# EAGLE design IOIO (EAGLE 5.11)
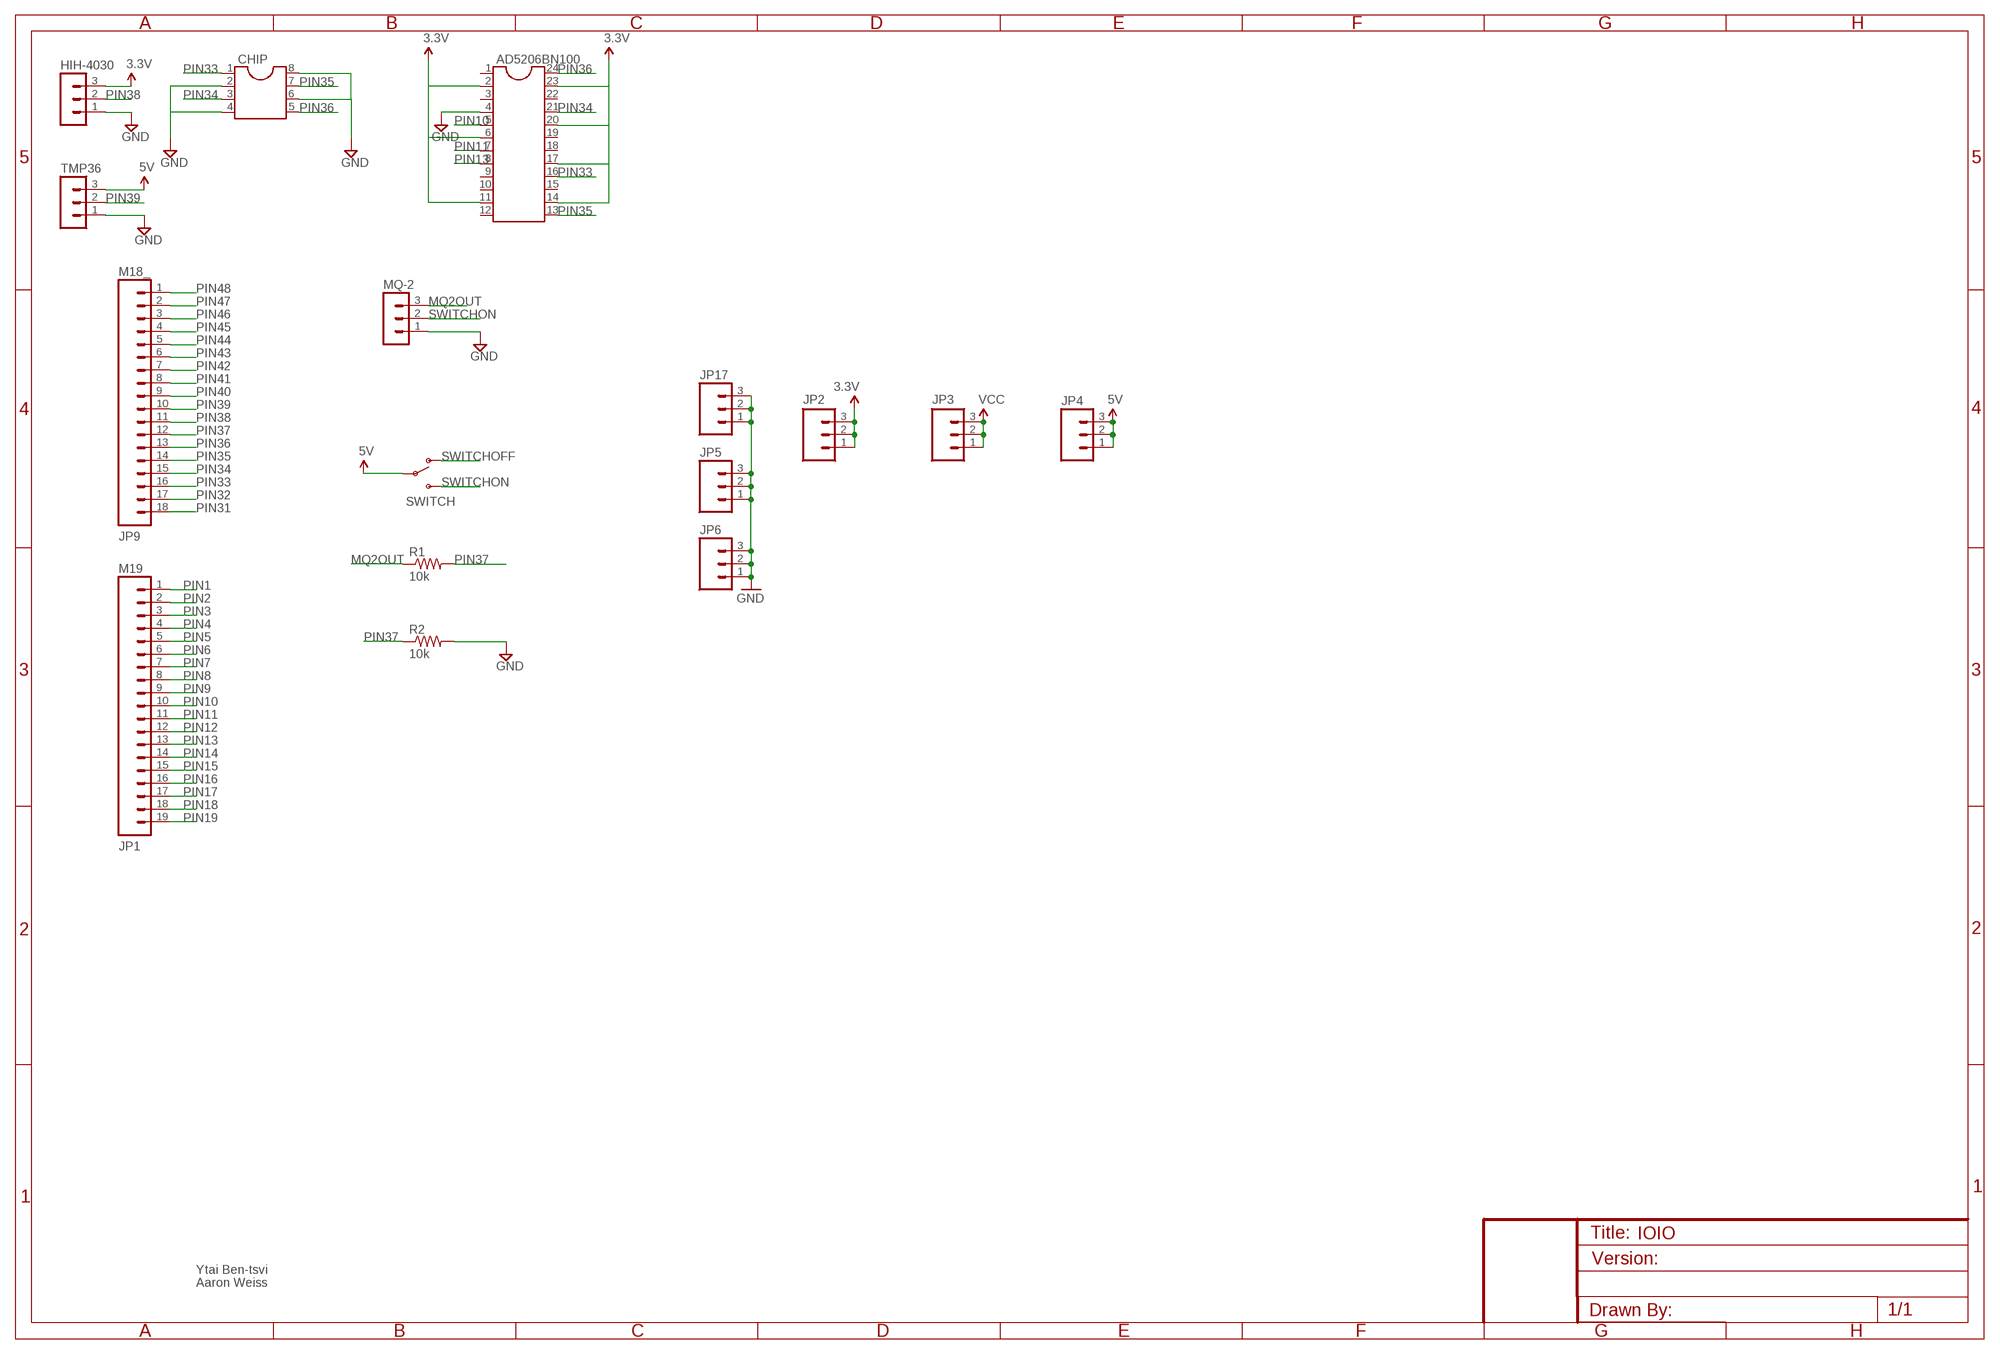
[diagram p0: schematic, sheet 1]

## Parts
AD5206BN100  DIL24-3  [DIL24-3]
CHIP  DIL8S  [SOCKET-08]
HIH-4030  MA03-1  [MA03-1]
JP1  M19  [1X19]
JP2  M03PTH  [1X03]
JP3  M03PTH  [1X03]
JP4  M03PTH  [1X03]
JP5  M03PTH  [1X03]
JP6  M03PTH  [1X03]
JP9  M18_  [1X18]
JP17  M03PTH  [1X03]
MQ-2  MA03-1  [MA03-1]
R1  10k  R-US_0207/7  [0207/7]
R2  10k  R-US_0207/7  [0207/7]
SWITCH  SWITCH-SPSTPTH_LOCK  [SWITCH-SPDT_LOCK.007S]
TMP36  MA03-1  [MA03-1]

## Nets
3.3V: AD5206BN100.2 AD5206BN100.6 AD5206BN100.11 AD5206BN100.14 AD5206BN100.17 AD5206BN100.20 AD5206BN100.23 HIH-4030.3 JP2.1 JP2.2 JP2.3
5V: JP4.1 JP4.2 JP4.3 SWITCH.2(P) TMP36.3
GND: AD5206BN100.4 CHIP.2 CHIP.4 CHIP.6 CHIP.8 HIH-4030.1 JP5.1 JP5.2 JP5.3 JP6.1 JP6.2 JP6.3 JP17.1 JP17.2 JP17.3 MQ-2.1 R2.2 TMP36.1
MQ2OUT: MQ-2.3 R1.1
PIN1: JP1.1
PIN2: JP1.2
PIN3: JP1.3
PIN4: JP1.4
PIN5: JP1.5
PIN6: JP1.6
PIN7: JP1.7
PIN8: JP1.8
PIN9: JP1.9
PIN10: AD5206BN100.5 JP1.10
PIN11: AD5206BN100.7 JP1.11
PIN12: JP1.12
PIN13: AD5206BN100.8 JP1.13
PIN14: JP1.14
PIN15: JP1.15
PIN16: JP1.16
PIN17: JP1.17
PIN18: JP1.18
PIN19: JP1.19
PIN31: JP9.18
PIN32: JP9.17
PIN33: AD5206BN100.16 CHIP.1 JP9.16
PIN34: AD5206BN100.21 CHIP.3 JP9.15
PIN35: AD5206BN100.13 CHIP.7 JP9.14
PIN36: AD5206BN100.24 CHIP.5 JP9.13
PIN37: JP9.12 R1.2 R2.1
PIN38: HIH-4030.2 JP9.11
PIN39: JP9.10 TMP36.2
PIN40: JP9.9
PIN41: JP9.8
PIN42: JP9.7
PIN43: JP9.6
PIN44: JP9.5
PIN45: JP9.4
PIN46: JP9.3
PIN47: JP9.2
PIN48: JP9.1
SWITCHOFF: SWITCH.1(O)
SWITCHON: MQ-2.2 SWITCH.3(S)
VCC: JP3.1 JP3.2 JP3.3
Unconnected: AD5206BN100.1 AD5206BN100.3 AD5206BN100.9 AD5206BN100.10 AD5206BN100.12 AD5206BN100.15 AD5206BN100.18 AD5206BN100.19 AD5206BN100.22

## Notes on the sheet
- Ytai Ben-tsvi
- Aaron Weiss

## Library data of the parts
AD5206BN100 = ic-package:DIL24: Dual In Line
CHIP = ic-package:DIL8: Dual In Line / Socket
HIH-4030 MQ-2 TMP36 = con-lstb:MA03-1: PIN HEADER; OC_FARNELL: unknown; OC_NEWARK: unknown
JP1 = SparkFun:M19
JP2-JP6 JP17 = SparkFun:M03: Header 3 Standard 3-pin 0.1" header. Use with straight break away headers (SKU : PRT-00116), right angle break away headers (PRT-00553), swiss pins (PRT-00743), machine pins (PRT-00117), and female headers (PRT-00115). Molex polarized connector foot print use with SKU : PRT-08232 with associated crimp pins and housings.
JP9 = SparkFun:M18
R1 R2 = resistor:R-US_: RESISTOR, American symbol
SWITCH = SparkFun:SWITCH-SPST: SPST Switch Simple slide switch. Spark Fun Electronics SKU : COM-00102

## Board
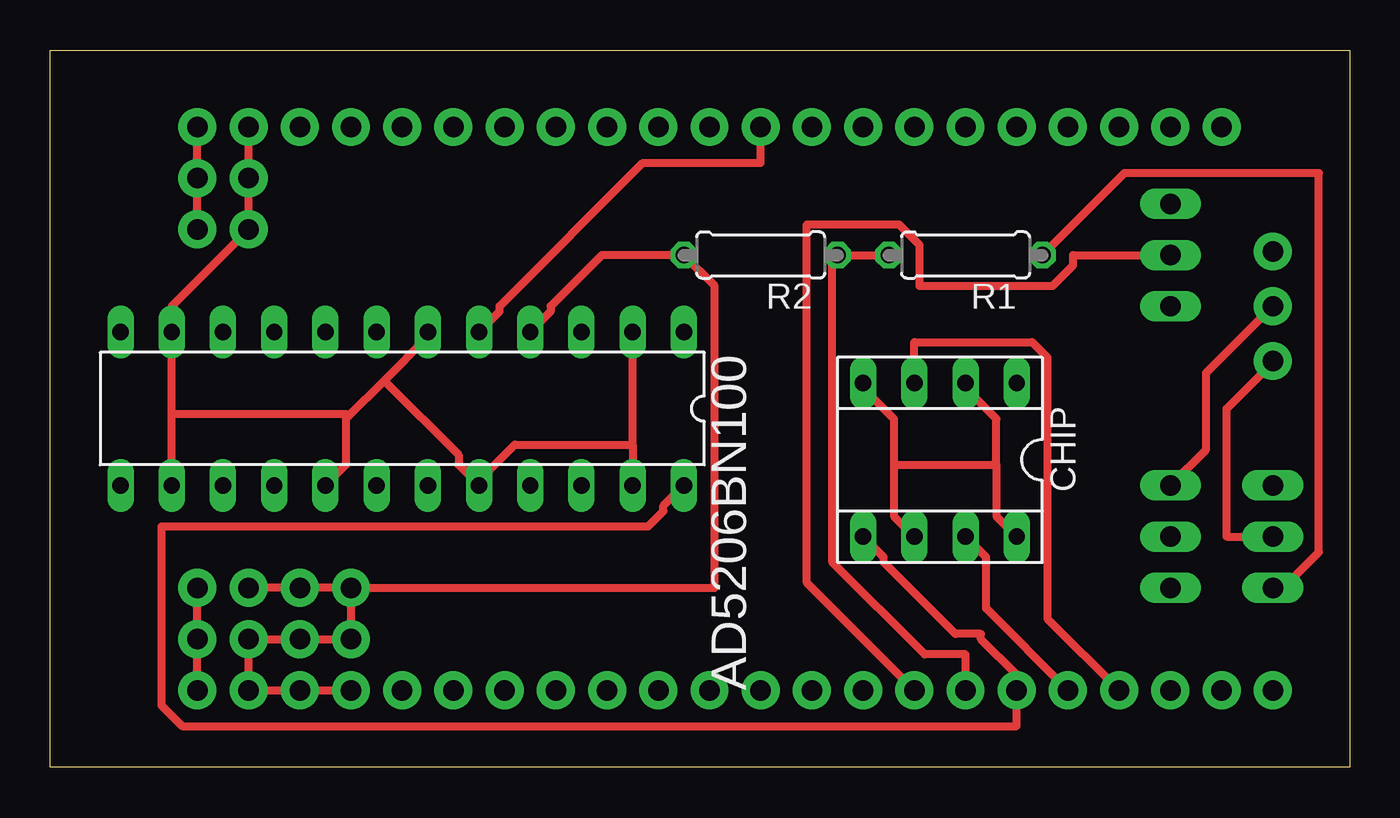
[diagram p1: board, top side]
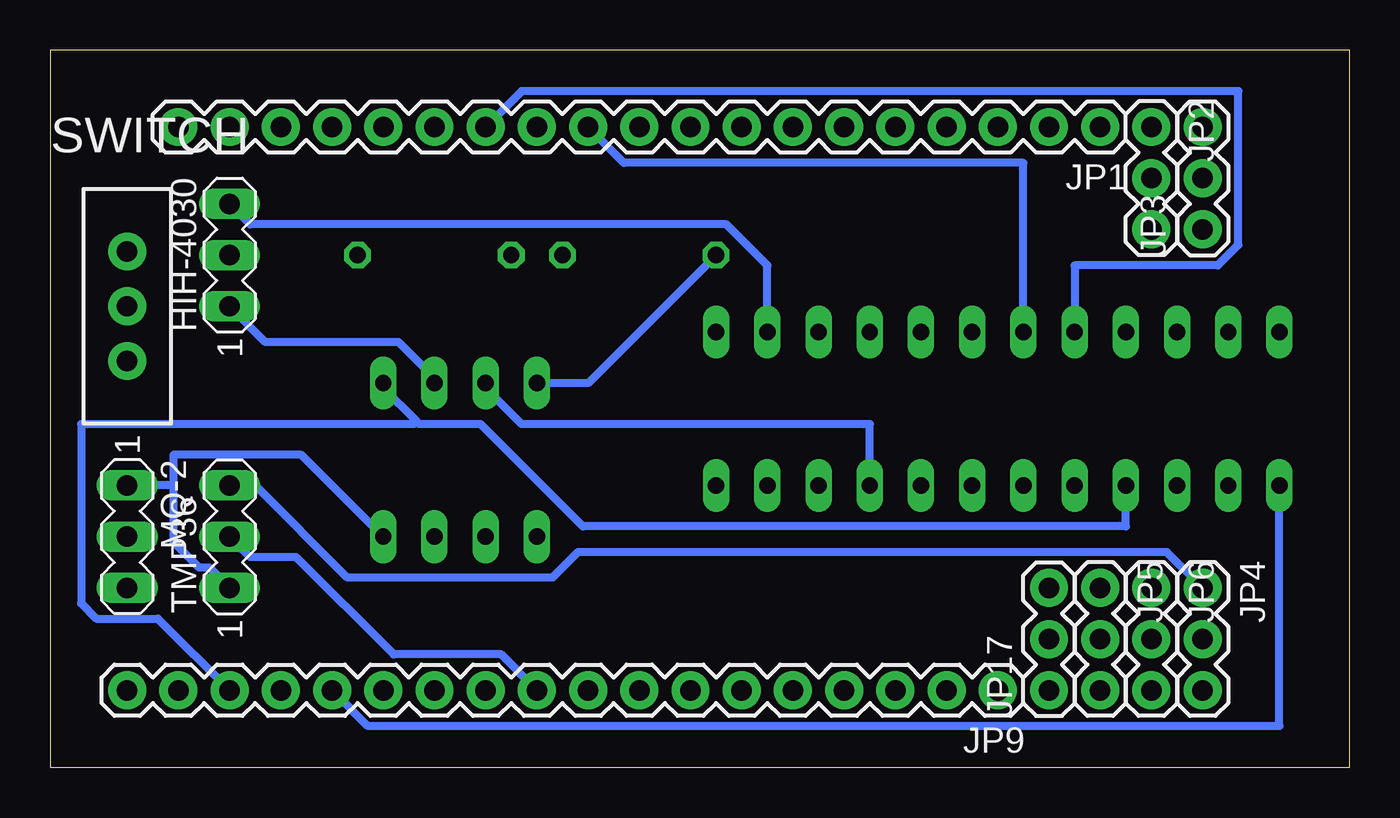
[diagram p2: board, bottom side, seen from below]

Size 64.44 x 35.55 mm. Coordinates in mm from the lower left corner, seen from the top.
Outline: 64.44,0 0,0 0,35.55 64.44,35.55 64.44,0
Copper layers (1*16): Top 0.035mm / dielectric 1.5mm / Bottom 0.035mm
Design rules "default *": minimum track width 16mil, minimum drill 24mil, track to track 20mil, track to pad 20mil, pad to pad 20mil, via to via 20mil, smd to smd 20mil, copper to edge 40mil, drill to drill 8mil, minimum pad ring 10mil, minimum via ring 8mil, stop-mask expansion 4mil, vias tented up to drill 0mil, thermal gap 10mil

### Footprints (pad centres in the part's own frame; a part is rotated, then mirrored left to right if it is on the bottom)
DIL24-3 = drill 0.813 long: 1 -13.97,-3.81; 2 -11.43,-3.81; 3 -8.89,-3.81; 4 -6.35,-3.81; 5 -3.81,-3.81; 6 -1.27,-3.81; 7 1.27,-3.81; 8 3.81,-3.81; 9 6.35,-3.81; 10 8.89,-3.81; 11 11.43,-3.81; 12 13.97,-3.81; 13 13.97,3.81; 14 11.43,3.81; 15 8.89,3.81; 16 6.35,3.81; 17 3.81,3.81; 18 1.27,3.81; 19 -1.27,3.81; 20 -3.81,3.81; 21 -6.35,3.81; 22 -8.89,3.81; 23 -11.43,3.81; 24 -13.97,3.81
SOCKET-08 = drill 0.813 long: 1 -3.81,-3.81; 2 -1.27,-3.81; 3 1.27,-3.81; 4 3.81,-3.81; 5 3.81,3.81; 6 1.27,3.81; 7 -1.27,3.81; 8 -3.81,3.81
MA03-1 = drill 1.016 long: 1 -2.54,0; 2 0,0; 3 2.54,0
1X19 = drill 1.016 pad 1.88 round: 1 0,0; 2 2.54,0; 3 5.08,0; 4 7.62,0; 5 10.16,0; 6 12.7,0; 7 15.24,0; 8 17.78,0; 9 20.32,0; 10 22.86,0; 11 25.4,0; 12 27.94,0; 13 30.48,0; 14 33.02,0; 15 35.56,0; 16 38.1,0; 17 40.64,0; 18 43.18,0; 19 45.72,0
1X03 = drill 1.016 pad 1.88 round: 1 0,0; 2 2.54,0; 3 5.08,0
1X18 = drill 1.016 pad 1.88 round: 1 0,0; 2 2.54,0; 3 5.08,0; 4 7.62,0; 5 10.16,0; 6 12.7,0; 7 15.24,0; 8 17.78,0; 9 20.32,0; 10 22.86,0; 11 25.4,0; 12 27.94,0; 13 30.48,0; 14 33.02,0; 15 35.56,0; 16 38.1,0; 17 40.64,0; 18 43.18,0
0207/7 = drill 0.813 octagon: 1 -3.81,0; 2 3.81,0
SWITCH-SPDT_LOCK.007S = drill 1.016 pad 1.88 round: 1 0,2.718; 2 0,0; 3 0,-2.718

### Placement (x,y rotation side)
AD5206BN100  17.45,17.78 180 top
CHIP  44.12,15.24 180 top
HIH-4030  55.55,25.4 90 bottom
JP1  12.37,31.75 180 bottom
JP2  9.83,31.75 270 bottom
JP3  7.29,26.67 90 bottom
JP4  7.29,8.89 270 bottom
JP5  12.37,8.89 270 bottom
JP6  9.83,8.89 270 bottom
JP9  17.45,3.81 180 bottom
JP17  14.91,3.81 90 bottom
MQ-2  60.63,11.43 270 bottom
R1  45.39,25.4 180 top
R2  35.23,25.4 180 top
SWITCH  60.63,22.86 0 bottom
TMP36  55.55,11.43 90 bottom

### Tracks (layer width: path | path; a pad name or v marks a point on that pad's centre or on a via)
3.3V
  Top 0.406: JP2.1 JP2.2 JP2.3 6.02,22.86 AD5206BN100.11 6.02,17.53 | AD5206BN100.14 6.02,17.53 | AD5206BN100.17 14.66,14.99 14.66,17.27 14.78,17.4 | 16.56,19.18 18.72,21.34 AD5206BN100.6 | 14.78,17.4 16.56,19.18 | 16.56,19.18 20.24,15.49 20.24,14.99 AD5206BN100.20 21.26,14.22 23.04,16 28.88,16 | 6.02,17.53 14.66,17.53 14.78,17.4 | 28.88,16 AD5206BN100.2 | 28.88,16 AD5206BN100.23
  Bottom 0.406: HIH-4030.3 54.53,26.92 30.91,26.92 28.88,24.89 AD5206BN100.2
5V
  Top 0.406: JP4.3 JP4.2 JP4.1 | TMP36.3 57.33,15.75 57.33,19.56 SWITCH.2
  Bottom 0.406: JP4.1 9.07,10.67 38.28,10.67 39.55,9.4 49.71,9.4 54.28,13.97 TMP36.3
GND
  Top 0.406: JP6.1 JP5.1 JP17.3 | JP17.1 JP5.3 JP6.3 JP6.2 JP5.2 JP17.2 JP17.3 | AD5206BN100.4 24.82,22.61 24.82,22.86 27.36,25.4 R2.2 32.94,23.88 32.94,8.89 JP17.3 | CHIP.6 41.83,12.45 41.83,14.99 | 41.83,14.99 41.83,17.27 40.31,18.8 CHIP.4 | CHIP.8 46.91,12.45 46.91,14.99 | 46.91,14.99 46.91,17.27 45.39,18.8 CHIP.2 | 41.83,14.99 46.91,14.99
  Bottom 0.406: TMP36.1 56.57,9.91 57.07,9.91 58.34,11.18 58.34,13.97 | 58.34,13.97 MQ-2.1 | HIH-4030.1 53.77,21.08 47.17,21.08 45.39,19.3 CHIP.2 | 58.34,13.97 58.34,15.49 51.99,15.49 CHIP.8 | R2.2 37.77,19.05 CHIP.4
MQ2OUT
  Top 0.406: R1.1 53.26,29.46 62.92,29.46 62.92,10.67 61.14,8.89 MQ-2.3
PIN10
  Top 0.406: AD5206BN100.5 22.28,22.61 22.28,22.86 29.39,29.97 35.23,29.97 JP1.10
PIN11
  Bottom 0.406: AD5206BN100.7 16.18,29.97 35.99,29.97 JP1.11
PIN13
  Bottom 0.406: AD5206BN100.8 13.64,24.89 6.53,24.89 5.51,25.91 5.51,33.53 41.07,33.53 JP1.13
PIN33
  Bottom 0.406: AD5206BN100.16 11.1,11.94 38.02,11.94 43.1,17.02 46.15,17.02 46.28,17.14 | 46.28,17.14 47.93,18.8 CHIP.1 | JP9.16 59.11,7.37 62.15,7.37 62.92,8.13 62.92,17.02 46.41,17.02 46.28,17.14
PIN34
  Top 0.406: JP9.15 49.45,7.37 49.45,20.32 48.69,21.08 42.85,21.08 CHIP.3
  Bottom 0.406: AD5206BN100.21 23.8,17.02 41.07,17.02 42.85,18.8 CHIP.3
PIN35
  Top 0.406: CHIP.7 46.41,10.41 46.41,7.87 JP9.14
  Bottom 0.406: AD5206BN100.13 3.48,2.03 48.69,2.03 JP9.14
PIN36
  Top 0.406: CHIP.5 41.33,10.41 41.33,10.16 44.88,6.6 46.15,6.6 46.15,6.35 47.93,4.57 JP9.13 47.93,2.03 6.53,2.03 5.51,3.05 5.51,11.94 29.64,11.94 30.4,12.7 30.4,12.95 AD5206BN100.24
PIN37
  Top 0.406: R1.2 R2.1 38.79,25.15 38.79,10.16 43.36,5.59 45.39,5.59 JP9.12
PIN38
  Top 0.406: HIH-4030.2 50.72,25.4 50.72,24.89 49.71,23.88 43.1,23.88 43.1,25.91 42.09,26.92 37.52,26.92 37.52,9.14 JP9.11
PIN39
  Bottom 0.406: TMP36.2 54.53,10.41 52.25,10.41 47.42,5.59 42.09,5.59 JP9.10
SWITCHON
  Top 0.406: MQ-2.2 58.34,11.43 58.34,17.78 60.63,20.07 SWITCH.3
VCC
  Top 0.406: JP3.1 JP3.2 JP3.3